# Altium schematic sheet SPI.SchDoc
size A; DocumentNumber: 1; SheetNumber: 1; SheetTotal: 1
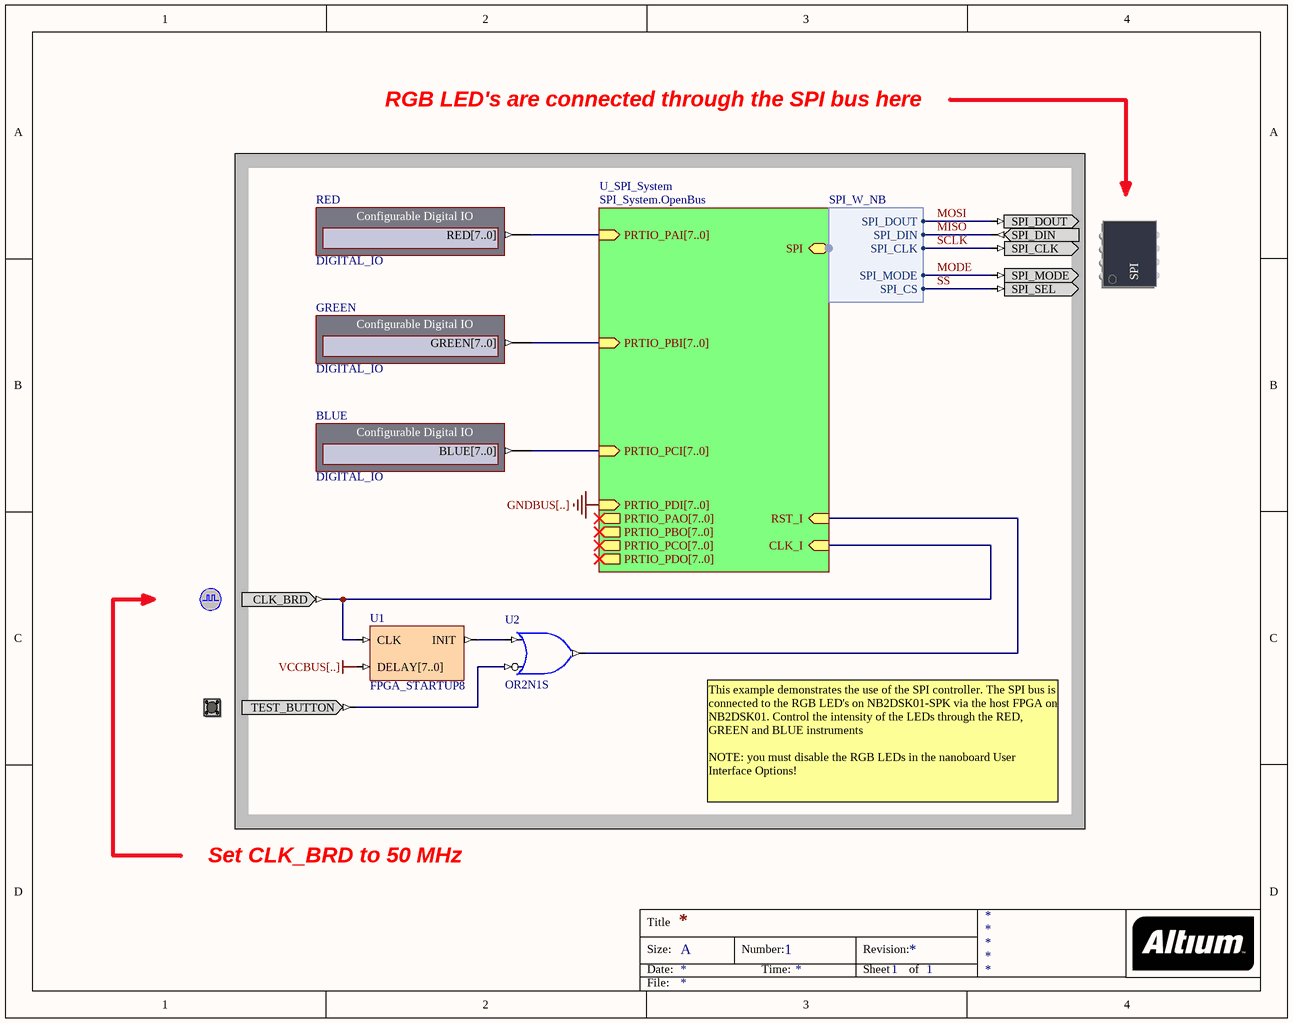
[diagram p0: SPI.SchDoc]

## Parts
(Parts that share a designator on the sheet are numbered #1, #2 ... from top to bottom, then left to right.)
?#1  SPI_BUS  (value not drawn)
?#2  CLOCK_BOARD  (value not drawn)
?#3  TEST_BUTTON  (value not drawn)
BLUE  DIGITAL_IO
GREEN  DIGITAL_IO
RED  DIGITAL_IO
U1  FPGA_STARTUP8
U2  OR2N1S

## Sub-sheets
U_SPI_System = SPI_System.OpenBus: CLK_I (in), RST_I (in), PRTIO_PAO[7..0] (out), PRTIO_PAI[7..0] (in), PRTIO_PDI[7..0] (in), PRTIO_PDO[7..0] (out), PRTIO_PBI[7..0] (in), PRTIO_PCI[7..0] (in), PRTIO_PCO[7..0] (out), PRTIO_PBO[7..0] (out), SPI (harness SPI_W_NB)

## Harnesses
SPI_W_NB: SPI_DOUT, SPI_DIN, SPI_CLK, SPI_MODE, SPI_CS

## Nets
VCCBUS[..]: U1.DELAY[7..0]
MISO: ?#1.SPI_DIN ; sheet U_SPI_System/SPI.SPI_DIN
MODE: ?#1.SPI_MODE ; sheet U_SPI_System/SPI.SPI_MODE
MOSI: ?#1.SPI_DOUT ; sheet U_SPI_System/SPI.SPI_DOUT
SCLK: ?#1.SPI_CLK ; sheet U_SPI_System/SPI.SPI_CLK
SS: ?#1.SPI_SEL ; sheet U_SPI_System/SPI.SPI_CS
Net?#2_CLK_BRD: ?#2.CLK_BRD U1.CLK ; sheet U_SPI_System/CLK_I
Net?#3_TEST_BUTTON: ?#3.TEST_BUTTON U2.I0
NetBLUE_BLUE[7..0]: BLUE.BLUE[7..0] ; sheet U_SPI_System/PRTIO_PCI[7..0]
NetGREEN_GREEN[7..0]: GREEN.GREEN[7..0] ; sheet U_SPI_System/PRTIO_PBI[7..0]
NetRED_RED[7..0]: RED.RED[7..0] ; sheet U_SPI_System/PRTIO_PAI[7..0]
NetU1_INIT: U1.INIT U2.I1
NetU2_O: U2.O ; sheet U_SPI_System/RST_I

## Notes on the sheet
- RGB LED's are connected through the SPI bus here
- This example demonstrates the use of the SPI controller. The SPI bus is connected to the RGB LED's on NB2DSK01-SPK via the host FPGA on NB2DSK01. Control the intensity of the LEDs through the RED, GREEN and BLUE instruments
  NOTE: you must disable the RGB LEDs in the nanoboard User Interface Options!
- Set CLK_BRD to 50 MHz
- Title
- Size:
- Date:
- A
- Number:
- Time:
- Revision:
- Sheet
- of
- File:
- (in symbol SPI_BUS) SPI

## Library data of the parts
?#1 = SPI_BUS: Generic SPI Bus; PortComponent: True; Published: 22-Jan-2007; Publisher: Altium Limited; HelpURL: TR0143 Technical Reference Manual for Altium's Desktop NanoBoard NB2DSK01.pdf#page=55
?#2 = CLOCK_BOARD: Global System Clock Supply; PortComponent: True; Published: 19-Nov-2003; Publisher: Altium Limited; HelpURL: TR0143 Technical Reference Manual for Altium's Desktop NanoBoard NB2DSK01.pdf#page=41; UseInDSF: True
?#3 = TEST_BUTTON: Test / Reset Button; PortComponent: True; Published: 19-Nov-2003; Publisher: Altium Limited; HelpURL: TR0143 Technical Reference Manual for Altium's Desktop NanoBoard NB2DSK01.pdf#page=53
BLUE = DIGITAL_IO: Configurable Digital IO; NEXUS_CORE: Instrument; NEXUS_JTAG_DEVICE: True; NEXUS_JTAG_ORDER: 0; ConfigurationParameters: {}Version[1.0]{}Output0Name[BLUE{1}7..0{2}]{}Output0Width[8]{}Output0InitValue[255]{}Output0Kind[Numeric]{}Output0NumRadix[Binary]{}; ConfiguratorName: DIGITAL_IO; ComponentLink1Description: Core &Resource Usage; ComponentLink1URL: CR0134 FPGA Instrument Resource Usage.pdf; Core Revision: 1.00.00; HelpURL: CR0179 DIGITAL_IO Configurable Digital IO Module.pdf; LastRevisionNo: 1.00.00; Published: 28-Jun-2007; Publisher: Altium Limited; UseInDSF: True
GREEN = DIGITAL_IO: Configurable Digital IO; NEXUS_CORE: Instrument; NEXUS_JTAG_DEVICE: True; NEXUS_JTAG_ORDER: 0; ConfigurationParameters: {}Version[1.0]{}Output0Name[GREEN{1}7..0{2}]{}Output0Width[8]{}Output0InitValue[255]{}Output0Kind[Numeric]{}Output0NumRadix[Binary]{}; ConfiguratorName: DIGITAL_IO; ComponentLink1Description: Core &Resource Usage; ComponentLink1URL: CR0134 FPGA Instrument Resource Usage.pdf; Core Revision: 1.00.00; HelpURL: CR0179 DIGITAL_IO Configurable Digital IO Module.pdf; LastRevisionNo: 1.00.00; Published: 28-Jun-2007; Publisher: Altium Limited; UseInDSF: True
RED = DIGITAL_IO: Configurable Digital IO; NEXUS_CORE: Instrument; NEXUS_JTAG_DEVICE: True; NEXUS_JTAG_ORDER: 0; ConfigurationParameters: {}Version[1.0]{}Output0Name[RED{1}7..0{2}]{}Output0Width[8]{}Output0InitValue[255]{}Output0Kind[Numeric]{}Output0NumRadix[Binary]{}; ConfiguratorName: DIGITAL_IO; ComponentLink1Description: Core &Resource Usage; ComponentLink1URL: CR0134 FPGA Instrument Resource Usage.pdf; Core Revision: 1.00.00; HelpURL: CR0179 DIGITAL_IO Configurable Digital IO Module.pdf; LastRevisionNo: 1.00.00; Published: 28-Jun-2007; Publisher: Altium Limited; UseInDSF: True
U1 = FPGA_STARTUP8: FPGA Startup With 8 Bit Delay; Published: 9-Dec-2004; Publisher: Altium Limited; HelpURL: CR0119 FPGA_STARTUPx Powerup Delay Unit.pdf; LastRevisionNo: 1.00.00; ComponentLink1Description: Core &Resource Usage; ComponentLink1URL: CR0139 FPGA Peripheral Resource Usage.pdf#page=11
U2 = OR2N1S: 2-Input OR Gate with Active Low A Input, Single Pin Version; XilinxEquivalent: OR2B1; FunctionalClass: Logic Primitive; PortSize: 2; ArchiveName: GENERIC; VHDLIB_SIM: GENERIC_LIB; Published: 29-Jan-2004; Publisher: Altium Limited; LastRevisionNo: 1.00.00; HelpURL: CR0118 FPGA Generic Library Guide.pdf#page=410; ComponentLink1URL: CR0136 FPGA Logic Primitive Resource Usage.pdf#page=187; ComponentLink1Description: Core &Resource Usage; SubClass: OR; PortStyle: Single Pin Version